# EAGLE design BTSwitch (EAGLE 5.11)
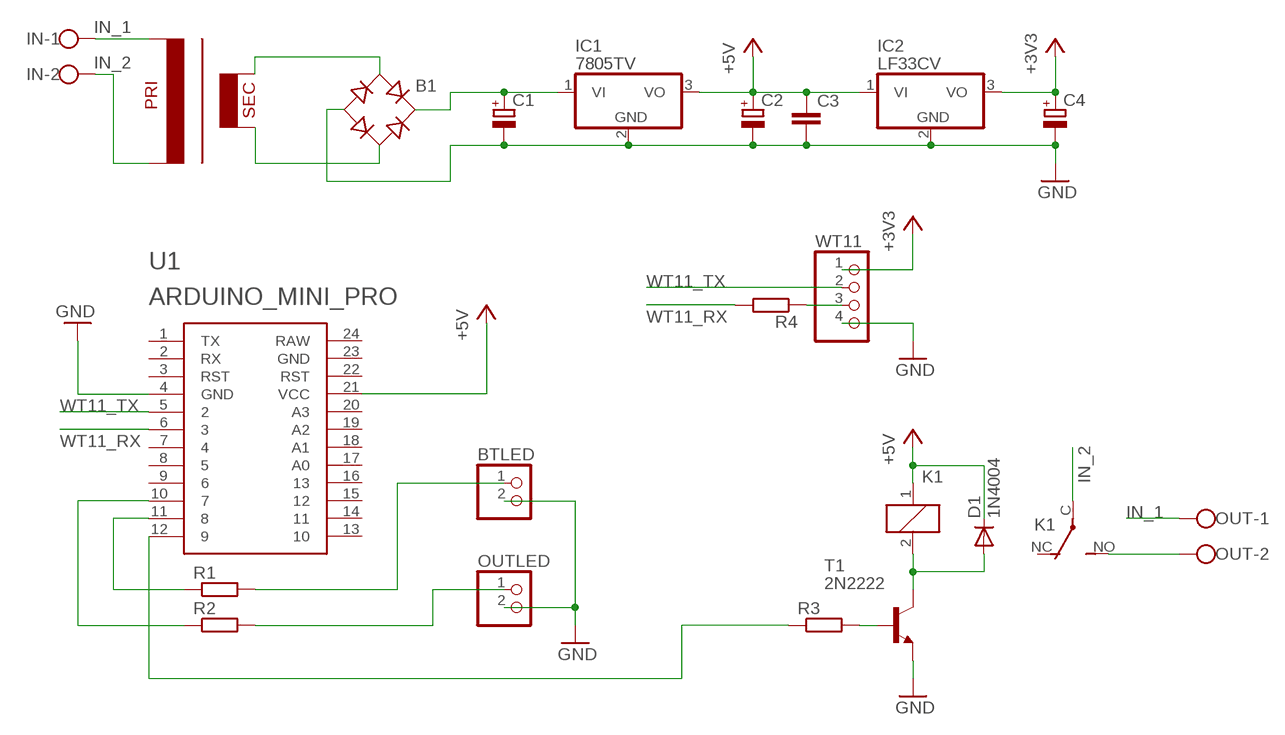
[diagram p0: schematic, sheet 1]

## Parts
B1  RECTIFIER-RB1A  [RB1A]
BTLED  PINHD-1X2  [1X02]
C1  CPOL-EUE2.5-6  [E2,5-6]
C2  CPOL-EUE2.5-6  [E2,5-6]
C3  C-EU050-030X075  [C050-030X075]
C4  CPOL-EUE2.5-6  [E2,5-6]
D1  1N4004  [DO41-10]
IC1  7805TV  [TO220V]
IC2  LF33CV  7805TV  [TO220V]
IN  W237-102  [W237-102]
K1  JS-M1-9V-4  [JS-M]
OUT  W237-102  [W237-102]
OUTLED  PINHD-1X2  [1X02]
R1  R-EU_0204/2V  [0204V]
R2  R-EU_0204/2V  [0204V]
R3  R-EU_0204/2V  [0204V]
R4  R-EU_0204/2V  [0204V]
T1  2N2222  [TO92-EBC-OVAL]
U1  ARDUINO_MINI_PRO  [DIL24-6]
U$1  TRAFO_VB_2_1_9  [TRAFO]
WT11  PINHD-1X4  [1X04]

## Nets
+3V3: C4.+ IC2.3(VO) WT11.1
+5V: C2.+ C3.1 D1.C IC1.3(VO) IC2.1(VI) K1.1 U1.21(VCC)
GND: B1.- BTLED.2 C1.- C2.- C3.2 C4.- IC1.2(GND) IC2.2(GND) OUTLED.2 T1.E U1.4(GND) WT11.4
IN_1 [power]: IN.1 OUT.1 U$1.P1
IN_2 [power]: IN.2 K1.C(2:P) U$1.P2
N$1: B1.AC1 U$1.P3
N$2: B1.AC2 U$1.P4
N$3: B1.+ C1.+ IC1.1(VI)
N$4 [power]: K1.NO(2:S) OUT.2
N$5: R1.1 U1.11
N$6: BTLED.1 R1.2
N$7: R2.1 U1.10
N$8: OUTLED.1 R2.2
N$9: R3.2 T1.B
N$10: D1.A K1.2 T1.C
N$11: R4.1 WT11.3
OUT: R3.1 U1.12
WT11_RX: R4.2 U1.6
WT11_TX: U1.5 WT11.2
Unconnected: K1.NC(2:O) U1.1(TX) U1.2(RX) U1.3(RST) U1.7 U1.8 U1.9 U1.13 U1.14 U1.15 U1.16 U1.17(A0) U1.18(A1) U1.19(A2) U1.20(A3) U1.22(RST) U1.23(GND) U1.24(RAW)

## Library data of the parts
B1 = rectifier:RECTIFIER-: Rectifier
BTLED OUTLED = pinhead:PINHD-1X2: PIN HEADER
C1 C2 C4 = rcl:CPOL-EU: POLARIZED CAPACITOR, European symbol
C3 = rcl:C-EU: CAPACITOR, European symbol
D1 = adafruit:1N4004: DIODE General purpose 1N400x type rectifier (With bigger pads) http://www.ladyada.net/library/pcb/eaglelibrary.html
IC1 IC2 = linear:78*: Positive VOLTAGE REGULATOR Source: http://cache.national.com/ds/LM/LM78L05.pdf http://www.fairchildsemi.com/ds/LM/LM7805.pdf
IN OUT = con-wago-500:W237-102: WAGO SCREW CLAMP; MPN: 237-102; OC_FARNELL: unknown; OC_NEWARK: 70K9898
K1 = relay:JS-M1*: Automotive Ultra-Miniature Power Relay NAiS Source: http://www.mew-europe.com/.. en_ds_61211_0000.pdf; OC_FARNELL: unknown; OC_NEWARK: unknown
R1-R4 = rcl:R-EU_: RESISTOR, European symbol
T1 = adafruit:2N2222: NPN TRANSISTOR Big oval pads
U1 = LD:ARDUINO_MINI_PRO
U$1 = LD:TRAFO_VB_2_1_9
WT11 = pinhead:PINHD-1X4: PIN HEADER

## Net classes
0 default: width 0.254 mm
1 power: width 2.54 mm

## Board
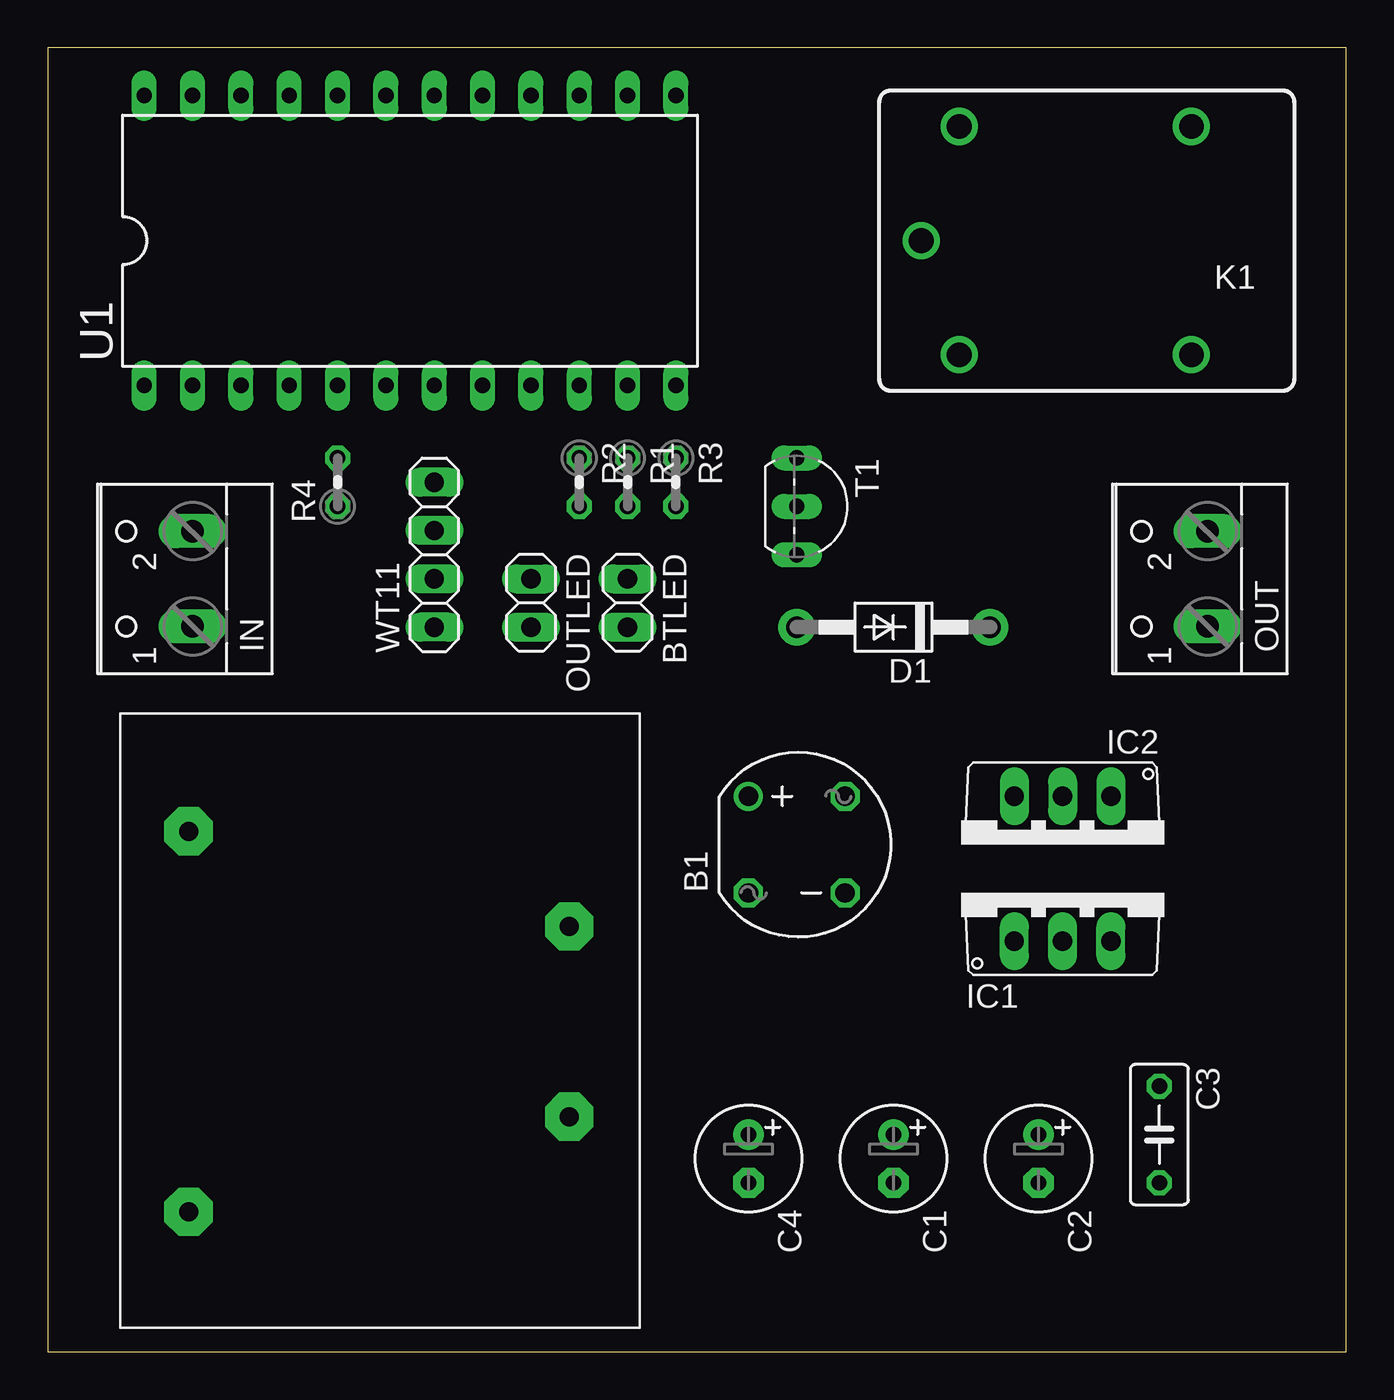
[diagram p1: board, top side]
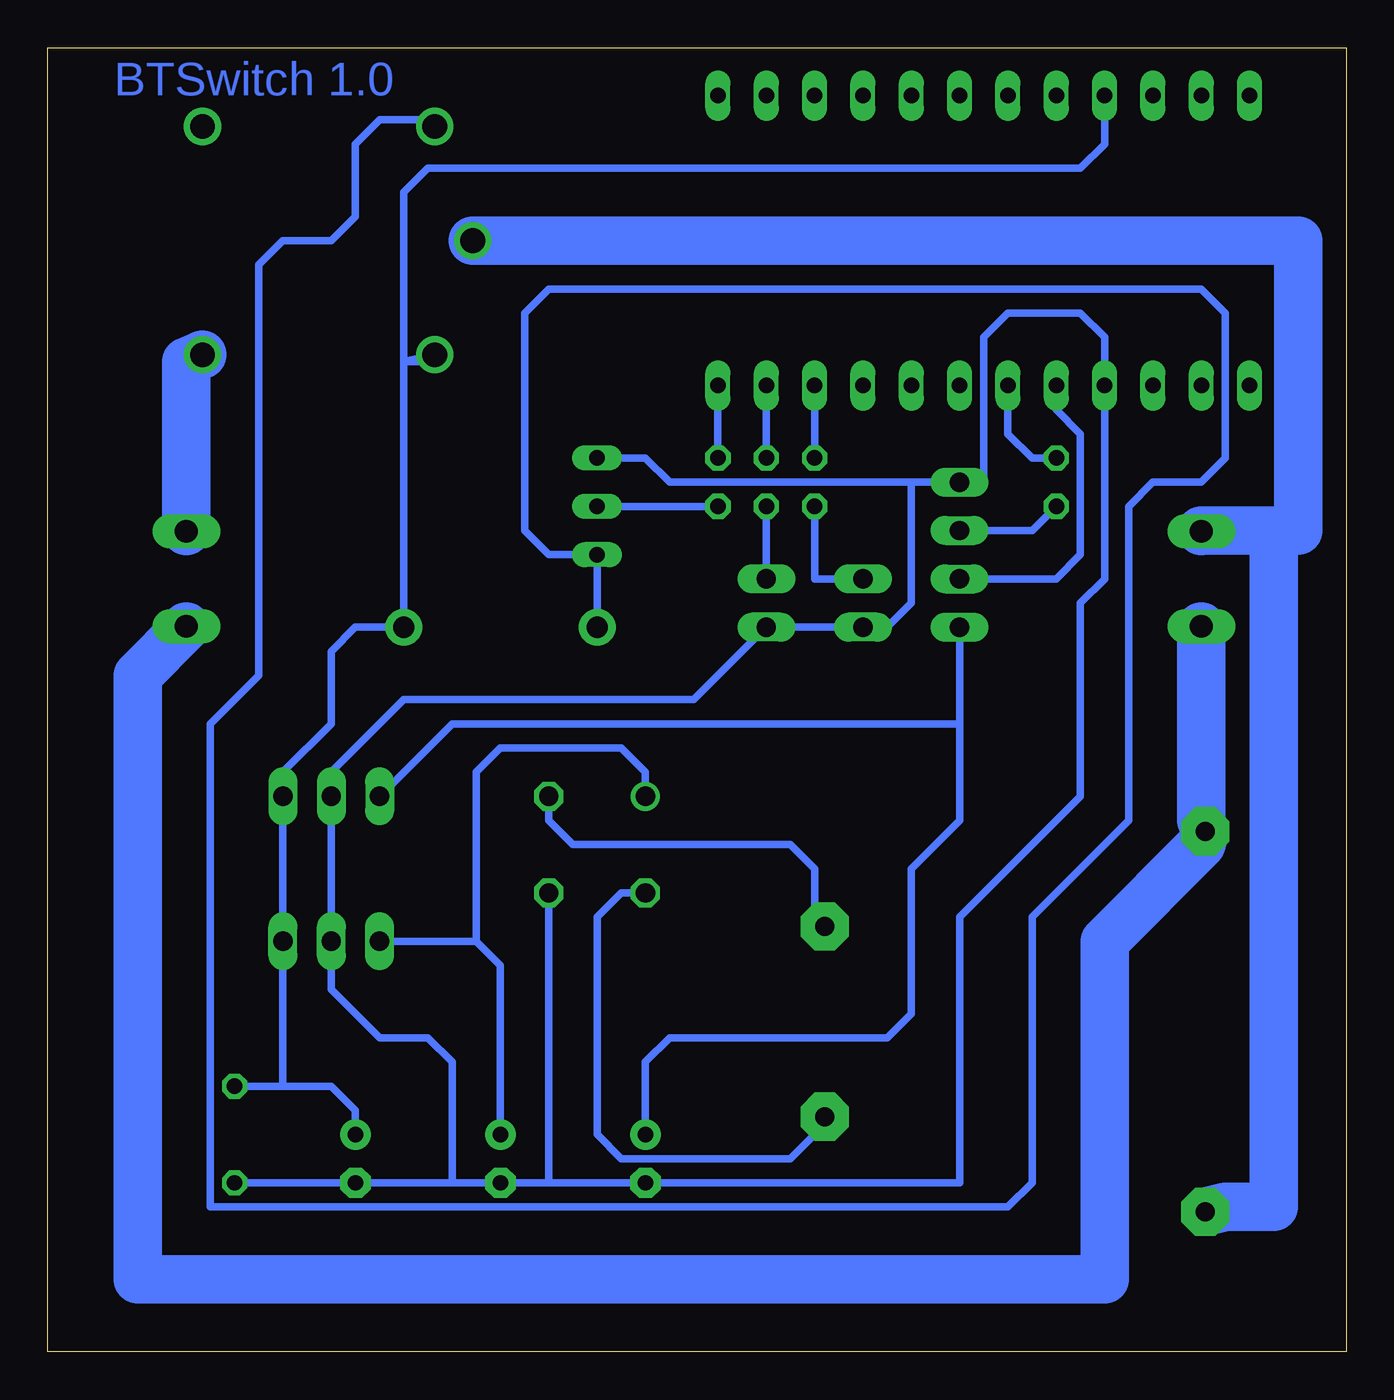
[diagram p2: board, bottom side, seen from below]

Size 68.25 x 68.57 mm. Coordinates in mm from the lower left corner, seen from the top.
Outline: 0,0 68.25,0 68.25,68.57 0,68.57 0,0
Copper layers (1*16): Top 0.035mm / dielectric 1.5mm / Bottom 0.035mm
Design rules "default *": minimum track width 16mil, minimum drill 24mil, track to track 10mil, track to pad 10mil, pad to pad 10mil, via to via 10mil, smd to smd 8mil, copper to edge 40mil, drill to drill 8mil, minimum pad ring 10mil, minimum via ring 8mil, stop-mask expansion 4mil, vias tented up to drill 0mil, thermal gap 10mil

### Footprints (pad centres in the part's own frame; a part is rotated, then mirrored left to right if it is on the bottom)
RB1A = drill 1.016 round: + -2.54,2.54 | drill 1.016 octagon: - 2.54,-2.54; AC1 2.54,2.54; AC2 -2.54,-2.54
1X02 = drill 1.016 long: 1 -1.27,0; 2 1.27,0
E2,5-6 = drill 0.813 pad 1.6 round: + -1.27,0 | drill 0.813 pad 1.6 octagon: - 1.27,0
C050-030X075 = drill 0.813 octagon: 1 -2.54,0; 2 2.54,0
DO41-10 = drill 1.118 pad 1.93 round: A 5.08,0; C -5.08,0
TO220V = drill 1.016 long: 1 -2.54,-2.54; 2 0,-2.54; 3 2.54,-2.54
W237-102 = drill 1.194 long: 1 -2.5,-1.27; 2 2.5,-1.27
JS-M = drill 1.3 round: 1 6.7,6; 2 6.7,-6; C 8.7,0; NC -5.5,-6; NO -5.5,6
0204V = drill 0.813 octagon: 1 -1.27,0; 2 1.27,0
TO92-EBC-OVAL = drill 0.813 long: B 0,-1.27; C 2.54,-1.27; E -2.54,-1.27
DIL24-6 = drill 0.813 long: 1 -13.97,-7.62; 2 -11.43,-7.62; 3 -8.89,-7.62; 4 -6.35,-7.62; 5 -3.81,-7.62; 6 -1.27,-7.62; 7 1.27,-7.62; 8 3.81,-7.62; 9 6.35,-7.62; 10 8.89,-7.62; 11 11.43,-7.62; 12 13.97,-7.62; 13 13.97,7.62; 14 11.43,7.62; 15 8.89,7.62; 16 6.35,7.62; 17 3.81,7.62; 18 1.27,7.62; 19 -1.27,7.62; 20 -3.81,7.62; 21 -6.35,7.62; 22 -8.89,7.62; 23 -11.43,7.62; 24 -13.97,7.62
TRAFO = drill 1 pad 2.54 octagon: P1 3.6,26.1; P2 3.6,6.1; P3 23.6,21.1; P4 23.6,11.1
1X04 = drill 1.016 long: 1 -3.81,0; 2 -1.27,0; 3 1.27,0; 4 3.81,0

### Placement (x,y rotation side)
B1  39.37,26.67 0 top
BTLED  30.48,39.37 270 top
C1  44.45,10.16 270 top
C2  52.07,10.16 270 top
C3  58.42,11.43 270 top
C4  36.83,10.16 270 top
D1  44.45,38.1 180 top
IC1  53.34,24.13 0 top
IC2  53.34,26.67 180 top
IN  6.35,40.64 90 top
K1  54.61,58.42 180 top
OUT  59.69,40.64 90 top
OUTLED  25.4,39.37 270 top
R1  30.48,45.72 270 top
R2  27.94,45.72 270 top
R3  33.02,45.72 270 top
R4  15.24,45.72 90 top
T1  40.64,44.45 270 top
U1  19.05,58.42 0 top
U$1  3.81,1.27 0 top
WT11  20.32,41.91 90 top

### Tracks (layer width: path | path; a pad name or v marks a point on that pad's centre or on a via)
+3V3
  Bottom 0.406: C4.+ 36.83,15.24 35.56,16.51 24.13,16.51 22.86,17.78 22.86,25.4 20.32,27.94 20.32,33.02 | 20.32,33.02 WT11.1 | IC2.3 46.99,33.02 20.32,33.02
+5V
  Bottom 0.406: C2.+ 52.07,12.7 53.34,13.97 C3.1 55.88,13.97 IC1.3 IC2.1 55.88,30.48 53.34,33.02 53.34,36.83 52.07,38.1 D1.C 49.53,52.07 | U1.21 12.7,63.5 13.97,62.23 48.26,62.23 49.53,60.96 49.53,52.07 | 49.53,52.07 K1.1 48.26,52.07 49.53,52.07
GND
  Bottom 0.406: T1.E 36.83,46.99 35.56,45.72 22.86,45.72 | 22.86,45.72 WT11.4 19.05,45.72 19.05,53.34 17.78,54.61 13.97,54.61 12.7,53.34 U1.4 12.7,40.64 13.97,39.37 13.97,29.21 20.32,22.86 20.32,8.89 C4.- 41.91,8.89 | 22.86,45.72 22.86,39.37 24.13,38.1 OUTLED.2 BTLED.2 34.29,34.29 49.53,34.29 53.34,30.48 IC2.2 IC1.2 53.34,19.05 50.8,16.51 48.26,16.51 46.99,15.24 46.99,8.89 | C3.2 C2.- C1.- 41.91,8.89 | 41.91,8.89 B1.-
IN_1
  Bottom 2.54: IN.1 7.62,27.94 U$1.P1 7.62,26.67 12.7,21.59 12.7,3.81 63.5,3.81 63.5,35.56 OUT.1
IN_2
  Bottom 2.54: 6.35,43.18 7.62,43.18 IN.2 6.35,43.18 | 3.81,43.18 3.81,7.62 6.35,7.62 U$1.P2 | 3.81,43.18 6.35,43.18 | 3.81,43.18 2.54,43.18 2.54,58.42 K1.C
N$1
  Bottom 0.406: B1.AC1 41.91,27.94 40.64,26.67 29.21,26.67 27.94,25.4 27.94,22.86 U$1.P3
N$2
  Bottom 0.406: B1.AC2 38.1,24.13 39.37,22.86 39.37,11.43 38.1,10.16 29.21,10.16 27.94,11.43 U$1.P4
N$3
  Bottom 0.406: C1.+ 44.45,20.32 45.72,21.59 | 45.72,21.59 IC1.1 | B1.+ 36.83,30.48 38.1,31.75 44.45,31.75 45.72,30.48 45.72,21.59
N$4
  Bottom 2.54: OUT.2 60.96,52.07 K1.NO
N$5
  Bottom 0.406: R1.1 U1.11
N$6
  Bottom 0.406: BTLED.1 R1.2
N$7
  Bottom 0.406: R2.1 U1.10
N$8
  Bottom 0.406: R2.2 27.94,40.64 OUTLED.1
N$9
  Bottom 0.406: R3.2 T1.B
N$10
  Bottom 0.406: D1.A T1.C 41.91,41.91 43.18,43.18 43.18,54.61 41.91,55.88 7.62,55.88 6.35,54.61 6.35,48.26 6.35,46.99 7.62,45.72 10.16,45.72 11.43,44.45 11.43,27.94 16.51,22.86 16.51,8.89 17.78,7.62 59.69,7.62 59.69,33.02 57.15,35.56 57.15,57.15 55.88,58.42 53.34,58.42 52.07,59.69 52.07,63.5 50.8,64.77 48.26,64.77 K1.2
N$11
  Bottom 0.406: R4.1 16.51,43.18 WT11.3
OUT
  Bottom 0.406: R3.1 U1.12
WT11_RX
  Bottom 0.406: R4.2 16.51,46.99 17.78,48.26 U1.6
WT11_TX
  Bottom 0.406: U1.5 15.24,49.53 13.97,48.26 13.97,41.91 15.24,40.64 WT11.2

### Text on the board
Bottom: BTSwitch 1.0